# Altium project CW308T_87C51.PrjPcb
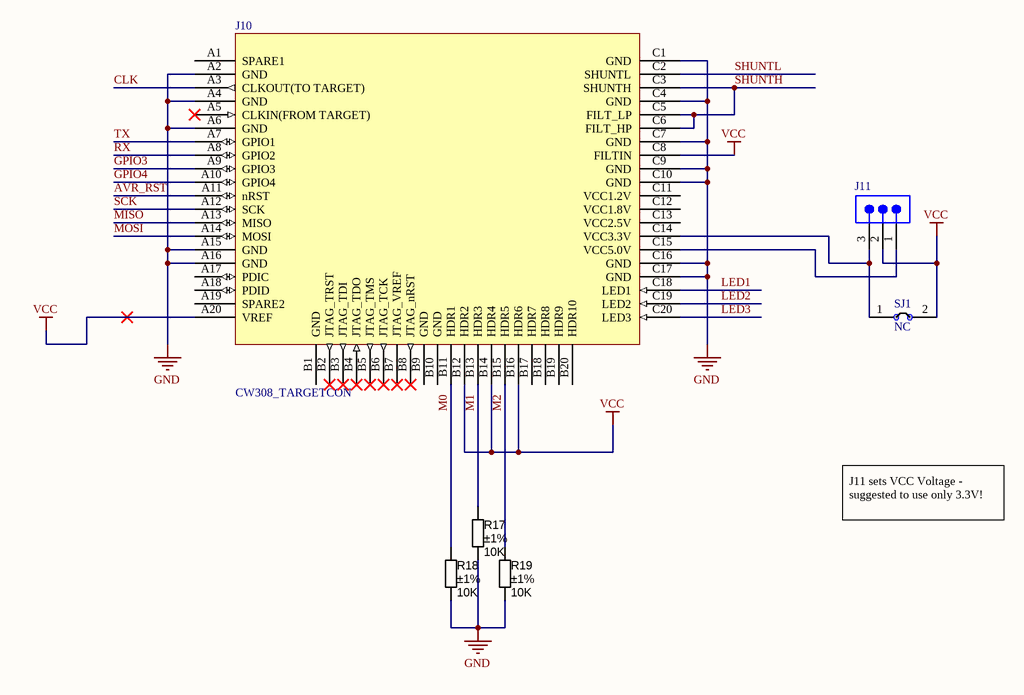
[diagram p0: CW308T_87C51_CWCONN.SchDoc]
PrjLicense: GPL; PrjName: NAE-CW308T-87C51; PrjRev: 02
2 sheets, 43 parts. Net scope: global (net labels, ports and power ports of the same name join across sheets).
Board file: CW308T_87C51.PcbDoc
Sheets:
  CW308T_87C51_CWCONN.SchDoc
  CW308T_87C51_CPU.SchDoc

## Sheet CW308T_87C51_CWCONN.SchDoc: CW308 Connections
size Letter; Organization: NewAE Technology Inc.; Address1: 1083 Queen St., Suite 196; Address2: Halifax; Address3: NS; Address4: Canada B3H 0B2; SheetApproved: YES

### Parts
J10  CW308_TARGETCON  [CW308_TBOARD_CONN]
J11  68000-203HLF  [SMTC-TSW-103-07-X-S]  (value not drawn)
R17  value 10K  Tolerance: ±1%  [RESC1608X55N]  (hidden comment: Thick Film)
R18  value 10K  Tolerance: ±1%  [RESC1608X55N]  (hidden comment: Thick Film)
R19  value 10K  Tolerance: ±1%  [RESC1608X55N]  (hidden comment: Thick Film)
SJ1  NC  [SJ_2S_NC]  (no BOM)

### Nets
GND: J10.A2(GND) J10.A4(GND) J10.A6(GND) J10.A15(GND) J10.A16(GND) J10.C1(GND) J10.C4(GND) J10.C7(GND) J10.C9(GND) J10.C10(GND) J10.C16(GND) J10.C17(GND) R17.2 R18.2 R19.1
VCC: J10.A20(VREF) J10.B12(HDR2) J10.B14(HDR4) J10.B16(HDR6) J10.C8(FILTIN) J11.2 SJ1.2
AVR_RST: J10.A11(nRST)
CLK: J10.A3(CLKOUT(TO_TARGET))
GPIO3: J10.A9(GPIO3)
GPIO4: J10.A10(GPIO4)
LED1: J10.C18(LED1)
LED2: J10.C19(LED2)
LED3: J10.C20(LED3)
M0: J10.B11(HDR1) R18.1
M1: J10.B13(HDR3) R17.1
M2: J10.B15(HDR5) R19.2
MISO: J10.A13(MISO)
MOSI: J10.A14(MOSI)
RX: J10.A8(GPIO2)
SCK: J10.A12(SCK)
SHUNTH: J10.C3(SHUNTH) J10.C5(FILT_LP) J10.C6(FILT_HP)
SHUNTL: J10.C2(SHUNTL)
TX: J10.A7(GPIO1)
NetJ10_C14: J10.C14(VCC3.3V) J11.3 SJ1.1
NetJ10_C15: J10.C15(VCC5.0V) J11.1

Not connected (* = marked no-connect by the designer): J10 A1(SPARE1) A5(CLKIN(FROM_TARGET))* A17(PDIC) A18(PDID) A19(SPARE2) B1(GND) B2(JTAG_TRST)* B3(JTAG_TDI)* B4(JTAG_TDO)* B5(JTAG_TMS)* B6(JTAG_TCK)* B7(JTAG_VREF)* B8(JTAG_nRST)* B9(GND) B10(GND) B17(HDR7) B18(HDR8) B19(HDR9) B20(HDR10) C11(VCC1.2V) C12(VCC1.8V) C13(VCC2.5V)

### Notes on the sheet
- J11 sets VCC Voltage - suggested to use only 3.3V!
- Title:
- Date:
- Rev:
- Time:
- Project:
- Sheet
- of
- License:
- Copyright © NewAE Technology Inc.
- Approved:
- NewAE.com
- File:

### Library data of the parts
J10 = CW308_TBOARD: CW308 "Standard" Target Board Connector
J11 = CMP-1024-00333-1: Manufacturer: Samtec; Pitch: 2.54 mm; Temperature Range: -55 to 125 degC; RoHS: True; Orientation: Vertical; PackageDescription: .025[0.64] SQ. Post Terminal Strip Assembly; Mounting Technology: Through-hole; PartNumber: 68000-203HLF; Supplier 1: Digi-Key; Supplier Part Number 1: 609-3464-ND
R17-R19 = RES_10K_0603_1%: Resistor SMD chip 10k Ohm 0.1W 1% 0603; Manufacturer 1: Yageo; Manufacturer Part Number 1: RC0603FR-0710KL; Ratings: 1/10W; SCDType: spec; Package / Case: 0603 (1608 Metric); Supplier 1: Digi-Key; Supplier Part Number 1: 311-10.0KHRCT-ND
SJ1 = SJ_2S: Solder Jumper, NC; Component Group: PCB Feature; Part Number: SJ_2S; Pin Count: 2; Mounting Technology: COPPER; Component Type: Standard (No BOM)

## Sheet CW308T_87C51_CPU.SchDoc: Main Microcontroller
size Letter; Organization: NewAE Technology Inc.; Address1: 1083 Queen St., Suite 196; Address2: Halifax; Address3: NS; Address4: Canada B3H 0B2; SheetApproved: YES
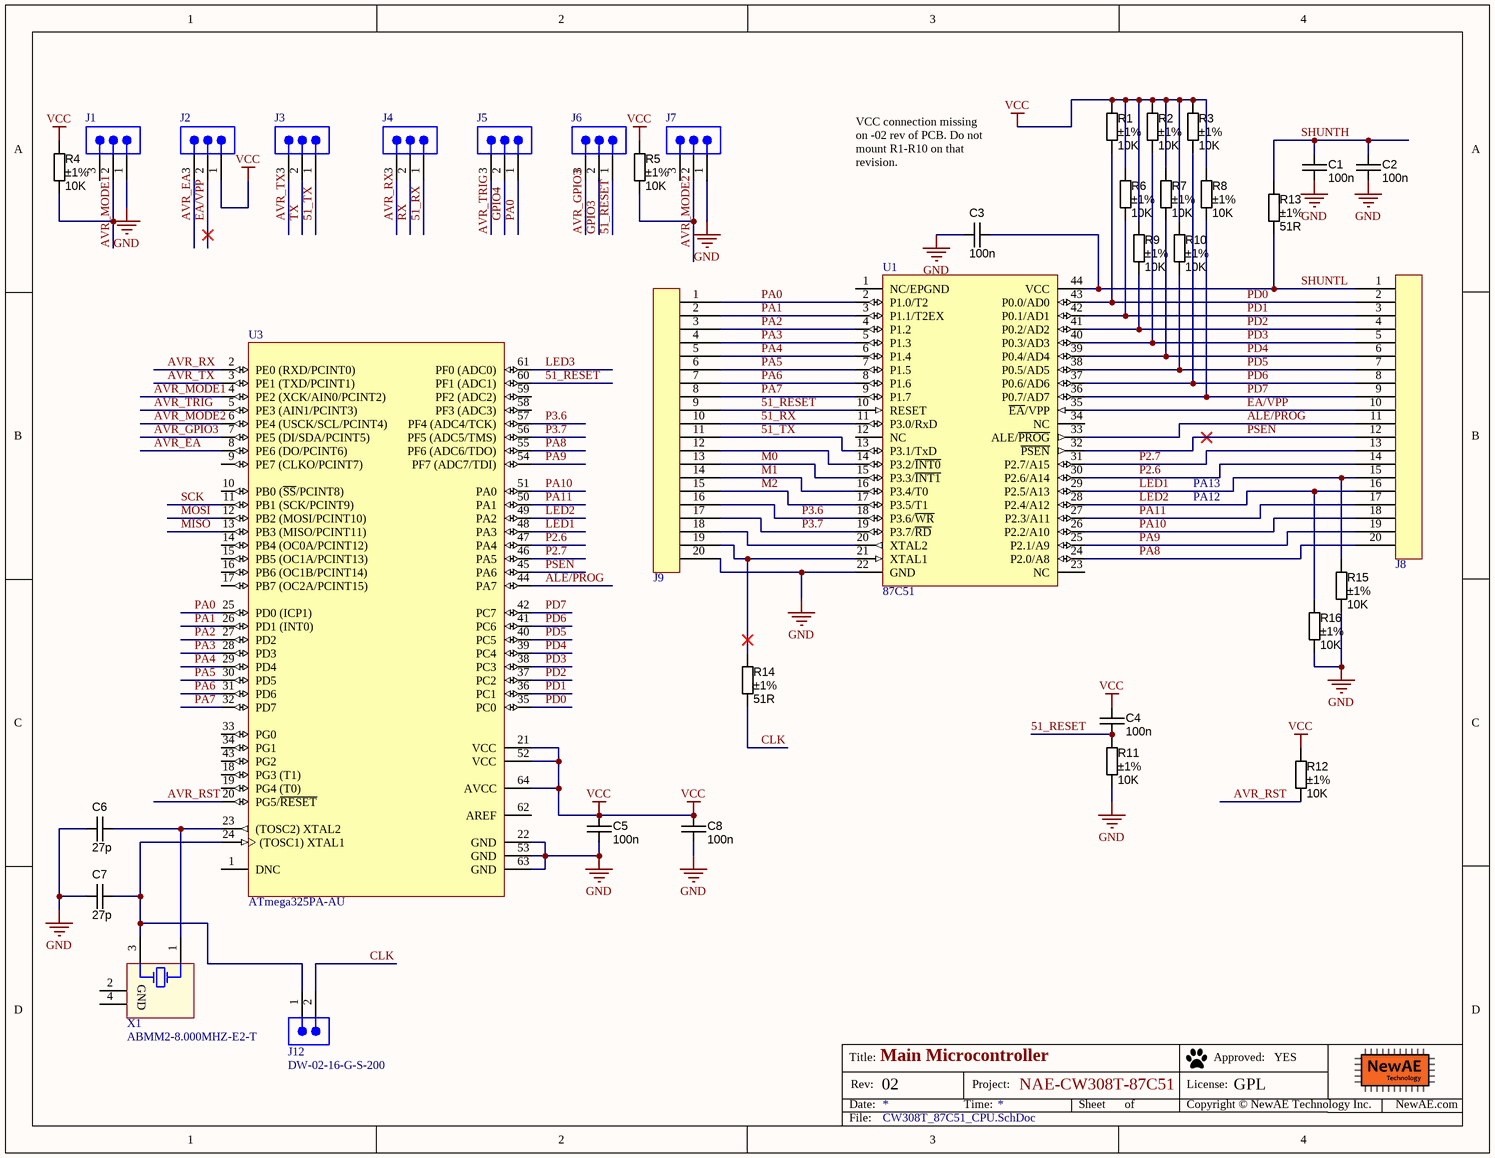
[diagram p1: CW308T_87C51_CPU.SchDoc]

### Parts
C1  value 100n  [CAPC1608X90N]  (hidden comment: approved sub OK)
C2  value 100n  [CAPC1608X90N]  (hidden comment: approved sub OK)
C3  value 100n  [CAPC1608X90N]  (hidden comment: approved sub OK)
C4  value 100n  [CAPC1608X90N]  (hidden comment: approved sub OK)
C5  value 100n  [CAPC1608X90N]  (hidden comment: approved sub OK)
C6  27p  [CAPC1608X90N]
C7  27p  [CAPC1608X90N]
C8  value 100n  [CAPC1608X90N]  (hidden comment: approved sub OK)
J1  68000-203HLF  [SMTC-TSW-103-07-X-S]  (value not drawn)
J2  68000-203HLF  [SMTC-TSW-103-07-X-S]  (value not drawn)
J3  68000-203HLF  [SMTC-TSW-103-07-X-S]  (value not drawn)
J4  68000-203HLF  [SMTC-TSW-103-07-X-S]  (value not drawn)
J5  68000-203HLF  [SMTC-TSW-103-07-X-S]  (value not drawn)
J6  68000-203HLF  [SMTC-TSW-103-07-X-S]  (value not drawn)
J7  68000-203HLF  [SMTC-TSW-103-07-X-S]  (value not drawn)
J8  20-Pin Header  [801-87-020-10-001101]  (value not drawn)
J9  20-Pin Header  [801-87-020-10-001101]  (value not drawn)
J12  DW-02-16-G-S-200  [SMTC-DW-02-16-X-S-200]
R1  value 10K  Tolerance: ±1%  [RESC1608X55N]  (hidden comment: Thick Film)
R2  value 10K  Tolerance: ±1%  [RESC1608X55N]  (hidden comment: Thick Film)
R3  value 10K  Tolerance: ±1%  [RESC1608X55N]  (hidden comment: Thick Film)
R4  value 10K  Tolerance: ±1%  [RESC1608X55N]  (hidden comment: Thick Film)
R5  value 10K  Tolerance: ±1%  [RESC1608X55N]  (hidden comment: Thick Film)
R6  value 10K  Tolerance: ±1%  [RESC1608X55N]  (hidden comment: Thick Film)
R7  value 10K  Tolerance: ±1%  [RESC1608X55N]  (hidden comment: Thick Film)
R8  value 10K  Tolerance: ±1%  [RESC1608X55N]  (hidden comment: Thick Film)
R9  value 10K  Tolerance: ±1%  [RESC1608X55N]  (hidden comment: Thick Film)
R10  value 10K  Tolerance: ±1%  [RESC1608X55N]  (hidden comment: Thick Film)
R11  value 10K  Tolerance: ±1%  [RESC1608X55N]  (hidden comment: Thick Film)
R12  value 10K  Tolerance: ±1%  [RESC1608X55N]  (hidden comment: Thick Film)
R13  value 51R  Tolerance: ±1%  [RESC1608X55N]  (hidden comment: Thick Film)
R14  value 51R  Tolerance: ±1%  [RESC1608X55N]  (hidden comment: Thick Film)
R15  value 10K  Tolerance: ±1%  [RESC1608X55N]  (hidden comment: Thick Film)
R16  value 10K  Tolerance: ±1%  [RESC1608X55N]  (hidden comment: Thick Film)
U1  87C51  [PLCC44_SOCKET]
U3  ATmega325PA-AU  [64A_M]
X1  ABMM2-8.000MHZ-E2-T  [ABRA-ABMM2-4_V]

### Nets
GND: C1.2 C2.2 C3.1 C5.2 C6.1 C7.1 C8.2 J1.1 J7.1 J9.20 R11.2 R15.2 R16.2 U1.22(GND) U3.22(GND) U3.53(GND) U3.63(GND)
VCC: C4.1 C5.1 C8.1 J2.1 R1.1 R2.1 R3.1 R4.1 R5.2 R6.1 R7.1 R8.1 R9.1 R10.1 R12.1 U3.21(VCC) U3.52(VCC) U3.64(AVCC)
51_RESET: C4.2 J6.1 J9.9 R11.1 U1.10(RESET) U3.60(PF1_(ADC1))
51_RX: J4.1 J9.10 U1.11(P3.0/RxD)
51_TX: J3.1 J9.11 U1.13(P3.1/TxD)
ALE/PROG: J8.11 U1.33(ALE/~{PROG}) U3.44(PA7)
AVR_EA: J2.3 U3.8(PE6_(DO/PCINT6))
AVR_GPIO3: J6.3 U3.7(PE5_(DI/SDA/PCINT5))
AVR_MODE1: J1.2 R4.2 U3.4(PE2_(XCK/AIN0/PCINT2))
AVR_MODE2: J7.2 R5.1 U3.6(PE4_(USCK/SCL/PCINT4))
AVR_RST: R12.2 U3.20(PG5/~{RESET})
AVR_RX: J4.3 U3.2(PE0_(RXD/PCINT0))
AVR_TRIG: J5.3 U3.5(PE3_(AIN1/PCINT3))
AVR_TX: J3.3 U3.3(PE1_(TXD/PCINT1))
CLK: J12.2 R14.2
EA/VPP: J2.2 J8.10 U1.35(~{EA}/VPP)
GPIO3: J6.2
GPIO4: J5.2
LED1: J8.15 R15.1 U1.29(P2.5/A13) U3.48(PA3)
LED2: J8.16 R16.1 U1.28(P2.4/A12) U3.49(PA2)
LED3: U3.61(PF0_(ADC0))
M0: J9.13 U1.15(P3.3/~{INT1})
M1: J9.14 U1.16(P3.4/T0)
M2: J9.15 U1.17(P3.5/T1)
MISO: U3.13(PB3_(MISO/PCINT11))
MOSI: U3.12(PB2_(MOSI/PCINT10))
P2.6: J8.14 U1.30(P2.6/A14) U3.47(PA4)
P2.7: J8.13 U1.31(P2.7/A15) U3.46(PA5)
P3.6: J9.16 U1.18(P3.6/~{WR}) U3.57(PF4_(ADC4/TCK))
P3.7: J9.17 U1.19(P3.7/~{RD}) U3.56(PF5_(ADC5/TMS))
PA0: J5.1 J9.1 U1.2(P1.0/T2) U3.25(PD0_(ICP1))
PA1: J9.2 U1.3(P1.1/T2EX) U3.26(PD1_(INT0))
PA2: J9.3 U1.4(P1.2) U3.27(PD2)
PA3: J9.4 U1.5(P1.3) U3.28(PD3)
PA4: J9.5 U1.6(P1.4) U3.29(PD4)
PA5: J9.6 U1.7(P1.5) U3.30(PD5)
PA6: J9.7 U1.8(P1.6) U3.31(PD6)
PA7: J9.8 U1.9(P1.7) U3.32(PD7)
PA8: J8.20 U1.24(P2.0/A8) U3.55(PF6_(ADC6/TDO))
PA9: J8.19 U1.25(P2.1/A9) U3.54(PF7_(ADC7/TDI))
PA10: J8.18 U1.26(P2.2/A10) U3.51(PA0)
PA11: J8.17 U1.27(P2.3/A11) U3.50(PA1)
PD0: J8.2 R1.2 U1.43(P0.0/AD0) U3.35(PC0)
PD1: J8.3 R6.2 U1.42(P0.1/AD1) U3.36(PC1)
PD2: J8.4 R9.2 U1.41(P0.2/AD2) U3.37(PC2)
PD3: J8.5 R2.2 U1.40(P0.3/AD3) U3.38(PC3)
PD4: J8.6 R7.2 U1.39(P0.4/AD4) U3.39(PC4)
PD5: J8.7 R10.2 U1.38(P0.5/AD5) U3.40(PC5)
PD6: J8.8 R3.2 U1.37(P0.6/AD6) U3.41(PC6)
PD7: J8.9 R8.2 U1.36(P0.7/AD7) U3.42(PC7)
PSEN: J8.12 U1.32(~{PSEN}) U3.45(PA6)
RX: J4.2
SCK: U3.11(PB1_(SCK/PCINT9))
SHUNTH: C1.1 C2.1 R13.1
SHUNTL: C3.2 J8.1 R13.2 U1.44(VCC)
TX: J3.2
NetC6_2: C6.2 U3.23((TOSC2)_XTAL2) X1.1(X1)
NetC7_2: C7.2 J12.1 U3.24((TOSC1)_XTAL1) X1.3(X2)
NetJ9_12: J9.12 U1.14(P3.2/~{INT0})
NetJ9_18: J9.18 U1.20(XTAL2)
NetJ9_19: J9.19 R14.1 U1.21(XTAL1)

Not connected (* = marked no-connect by the designer): J1 3; J7 3; U1 1(NC/EPGND) 12(NC) 23(NC) 34(NC); U3 1(DNC) 9(PE7_(CLKO/PCINT7)) 10(PB0_(~{SS}/PCINT8)) 14(PB4_(OC0A/PCINT12)) 15(PB5_(OC1A/PCINT13)) 16(PB6_(OC1B/PCINT14)) 17(PB7_(OC2A/PCINT15)) 18(PG3_(T1)) 19(PG4_(T0)) 33(PG0) 34(PG1) 43(PG2) 58(PF3_(ADC3)) 59(PF2_(ADC2)) 62(AREF); X1 2(GND) 4(GND)

### Notes on the sheet
- VCC connection missing on -02 rev of PCB. Do not mount R1-R10 on that revision.
- PA12
- PA13
- Title:
- Date:
- Rev:
- Time:
- Project:
- Sheet
- of
- License:
- Copyright © NewAE Technology Inc.
- Approved:
- NewAE.com
- File:

### Library data of the parts
C1-C5 C8 = CAPC_100n_0603_X7R_50V_10%: Capacitor SMD Cer 100nF 10% 50V X7R 0603; Manufacturer 1: AVX Corporation; Manufacturer Part Number 1: 06035C104KAT2A; Ratings: 50V; X7R; Material: ceramic; SCDType: spec; Manufacturer 2: TDK Corporation; Manufacturer Part Number 2: C1608X7R1H104K; Package / Case: 0603 (1608 Metric); Tolerance: ±10%; Supplier 1: Digi-Key; Supplier Part Number 1: 478-5052-1-ND; ComponentLink1URL: http://www.avx.com/docs/Catalogs/cx7r.pdf; ComponentLink1Description: http://www.avx.com/docs/Catalogs/cx7r.pdf; Supplier 2: Digi-Key; Supplier Part Number 2: 445-1314-1-ND; ComponentLink2URL: http://product.tdk.com/capacitor/mlcc/en/documents/mlcc_commercial_general_en.pdf; ComponentLink2Description: http://product.tdk.com/capacitor/mlcc/en/documents/mlcc_commercial_general_en.pdf
C6 C7 = CAPC_27p_0603_NP0_100V_1%: Capacitor SMD Cer 27pF 1% 100V NP0 0603; Manufacturer 1: AVX Corporation; Manufacturer Part Number 1: 06031A270FAT2A; Ratings: 100V; NP0; SCDType: undef; Tolerance: ±1%; Operating Temperature: -55°C ~ 125°C; Package / Case: 0603 (1608 Metric); Supplier 1: Digi-Key; Supplier Part Number 1: 478-3681-1-ND; Value: 27p
J1-J7 = CMP-1024-00333-1: Manufacturer: Samtec; Pitch: 2.54 mm; Temperature Range: -55 to 125 degC; RoHS: True; Orientation: Vertical; PackageDescription: .025[0.64] SQ. Post Terminal Strip Assembly; Mounting Technology: Through-hole; PartNumber: 68000-203HLF; Supplier 1: Digi-Key; Supplier Part Number 1: 609-3464-ND
J8 J9 = 801-87-020-10-001101: 1x20 Header, Machined; Manufacture 1: Preci-Dip SA; Manufacture Part Number 1: 801-87-020-10-001101; Supplier 1: Digi-Key; Supplier Part Number 1: 1212-1207-ND
J12 = CMP-1024-00001-1: Manufacturer: Samtec; Pitch: 2.54 mm; ComponentLink1Description: Manufacturer URL; ComponentLink3Description: Package Specification; DatasheetVersion: F-214; PartNumber: DW-02-16-G-S-200; ComponentLink1URL: http://www.samtec.com; RoHS: True; PackageVersion: AX, 8/1984; ComponentLink2URL: http://www.samtec.com/documents/webfiles/pdf/DW.PDF; ComponentLink2Description: Datasheet; Orientation: Vertical; PackageReference: DW-02-16-X-S-200; PackageDescription: Low Cost Board Spacer; ComponentLink3URL: http://www.samtec.com/documents/webfiles/cpdf/XW-XX-XX-XXX-X-XXXX-XXX-XX-XXX-MKT1.PDF; Mounting Technology: Through-hole; Temperature Range: -55 to 125 degC
R1-R12 R15 R16 = RES_10K_0603_1%: as R17 on sheet CW308T_87C51_CWCONN; Package / Case: 0603 (1608 Metric); Supplier 1: Digi-Key; Supplier Part Number 1: 311-10.0KHRCT-ND
R13 R14 = RES_51R_0603_1%: Resistor SMD chip 51 Ohm 0.1W 1% 0603; Manufacturer 1: Yageo; Manufacturer Part Number 1: RC0603FR-0751RL; Ratings: 1/10 W; SCDType: spec; Package / Case: 0603 (1608 metric); Material: Thick Film; Supplier 1: Digi-Key; Supplier Part Number 1: 311-51.0HRCT-ND
U3 = CMP-0095-00596-1: 8-bit AVR Microcontroller, 1.5-5.5V, 32KB Flash, 1KB EEPROM, 2KB SRAM, 64-pin TQFP, Industrial Grade (-40°C to 85°C); ComponentLink1Description: Manufacturer URL; PackageDescription: 64-Pin Plastic Thin Profile Quad Flat Pack, 14 x 14 x 1.0 mm Body, 0.8 mm Pitch (TQFP); Code_JEDEC: MS-026-AEB; ComponentLink2Description: ATmega165A/PA/325A/PA/3250A/PA/645A/P/6450A/P Datasheet; ComponentLink3Description: ATmega165A/PA/325A/PA/3250A/PA/645A/P/6450A/P Summary; ComponentLink2URL: http://www.atmel.com/dyn/resources/prod_documents/doc8285.pdf; PackageReference: 64A; ComponentLink3URL: http://www.atmel.com/dyn/resources/prod_documents/8285S.pdf; ComponentLink1URL: http://www.atmel.com/; DatasheetVersion: revD, Jun-2011; PackageVersion: revC, Oct-2010
X1 = CMP-0277-00003-1: Ceramic Surface Mount Low Profile Quartz Crystal, 8 MHz, -20 to 70 degC, 4-Pin 6 x 3.6 x 1.2 mm SMD, RoHS, 1000pcs / Reel; Manufacturer: Abracon; ESR: 72 Ohm Max.; Frequency: 8 MHz; Shunt Capacitance C0: 7 pF Max.; Load Capacitance CL: 18 pF Typ.; ComponentLink3Description: Package Specification; PackageDescription: 4-Pin SMD, Body 6 x 3.6 mm, Pitch 4.4 mm; DatasheetVersion: Jan-13; ComponentLink1URL: http://www.abracon.com/; ComponentLink2URL: http://www.abracon.com/Resonators/ABMM2.pdf; Temperature Range: -20 to 70 degC; Mounting Technology: Surface Mount; RoHS: TRUE; PartNumber: ABMM2-8.000MHZ-E2-T; ComponentLink2Description: Datasheet; ComponentLink3URL: http://www.abracon.com/Resonators/ABMM2.pdf; ComponentLink1Description: Manufacturer URL; Packing: 1000pcs / Reel

## Nets that join several sheets
GND: CW308T_87C51_CWCONN (15 pins), CW308T_87C51_CPU (17 pins)
VCC: CW308T_87C51_CWCONN (7 pins), CW308T_87C51_CPU (18 pins)
AVR_RST: CW308T_87C51_CWCONN (J10.A11), CW308T_87C51_CPU (R12.2 U3.20)
CLK: CW308T_87C51_CWCONN (J10.A3), CW308T_87C51_CPU (J12.2 R14.2)
GPIO3: CW308T_87C51_CWCONN (J10.A9), CW308T_87C51_CPU (J6.2)
GPIO4: CW308T_87C51_CWCONN (J10.A10), CW308T_87C51_CPU (J5.2)
LED1: CW308T_87C51_CWCONN (J10.C18), CW308T_87C51_CPU (J8.15 R15.1 U1.29 U3.48)
LED2: CW308T_87C51_CWCONN (J10.C19), CW308T_87C51_CPU (J8.16 R16.1 U1.28 U3.49)
LED3: CW308T_87C51_CWCONN (J10.C20), CW308T_87C51_CPU (U3.61)
M0: CW308T_87C51_CWCONN (J10.B11 R18.1), CW308T_87C51_CPU (J9.13 U1.15)
M1: CW308T_87C51_CWCONN (J10.B13 R17.1), CW308T_87C51_CPU (J9.14 U1.16)
M2: CW308T_87C51_CWCONN (J10.B15 R19.2), CW308T_87C51_CPU (J9.15 U1.17)
MISO: CW308T_87C51_CWCONN (J10.A13), CW308T_87C51_CPU (U3.13)
MOSI: CW308T_87C51_CWCONN (J10.A14), CW308T_87C51_CPU (U3.12)
RX: CW308T_87C51_CWCONN (J10.A8), CW308T_87C51_CPU (J4.2)
SCK: CW308T_87C51_CWCONN (J10.A12), CW308T_87C51_CPU (U3.11)
SHUNTH: CW308T_87C51_CWCONN (J10.C3 J10.C5 J10.C6), CW308T_87C51_CPU (C1.1 C2.1 R13.1)
SHUNTL: CW308T_87C51_CWCONN (J10.C2), CW308T_87C51_CPU (C3.2 J8.1 R13.2 U1.44)
TX: CW308T_87C51_CWCONN (J10.A7), CW308T_87C51_CPU (J3.2)